# Altium schematic sheet Sheet2.SchDoc
size A4
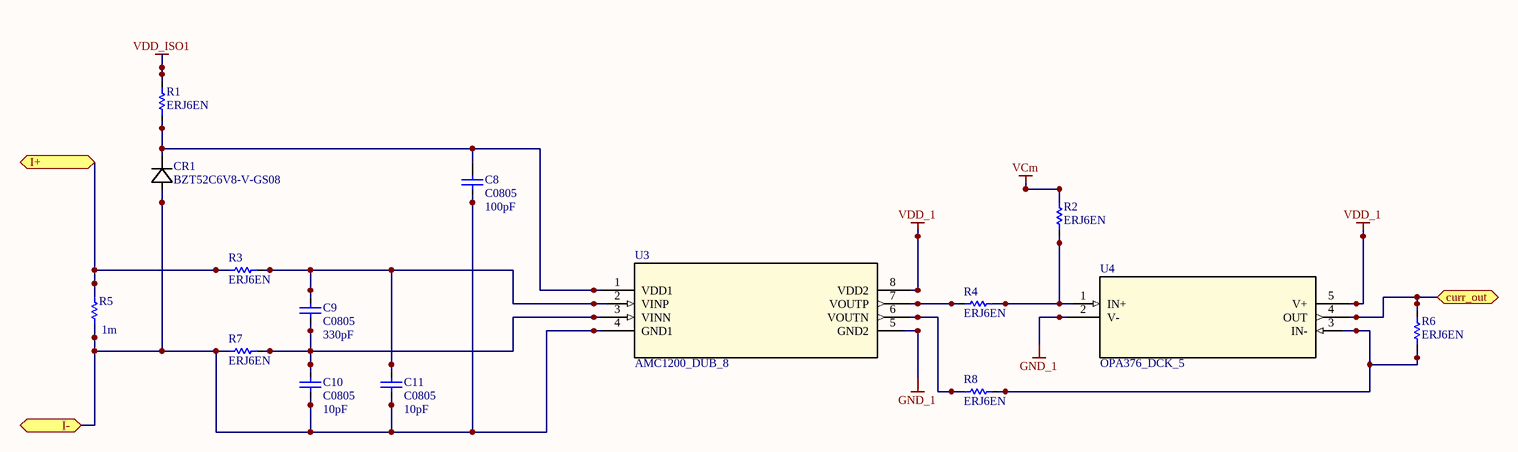
[diagram p0: Sheet2.SchDoc]

## Parts
C8  C0805  value 100pF  [0805]
C9  C0805  value 330pF  [0805]
C10  C0805  value 10pF  [0805]
C11  C0805  value 10pF  [0805]
CR1  BZT52C6V8-V-GS08  [SOD123]
R1  ERJ6EN  [6-0805]
R2  ERJ6EN  [6-0805]
R3  ERJ6EN  [6-0805]
R4  ERJ6EN  [6-0805]
R5  value 1m  [M1WT-2512]  (hidden comment: ERJM1WT)
R6  ERJ6EN  [6-0805]
R7  ERJ6EN  [6-0805]
R8  ERJ6EN  [6-0805]
U3  AMC1200_DUB_8  [DUB8]
U4  OPA376_DCK_5  [DCK5]

## Ports
curr_out, I+, I-

## Nets
GND_1: U3.5(GND2) U4.2(V-)
VCm: R2.2
VDD_1: U3.8(VDD2) U4.5(V+)
VDD_ISO1: R1.2
curr_out: R6.2 U4.4(OUT) ; port curr_out
I+: R3.1 R5.2 ; port I+
I-: C8.1 C10.1 C11.1 CR1.2 R5.1 R7.1 U3.4(GND1) ; port I-
NetC8_2: C8.2 CR1.1 R1.1 U3.1(VDD1)
NetC9_1: C9.1 C10.2 R7.2 U3.3(VINN)
NetC9_2: C9.2 C11.2 R3.2 U3.2(VINP)
NetR2_1: R2.1 R4.2 U4.1(IN+)
NetR4_1: R4.1 U3.7(VOUTP)
NetR6_1: R6.1 R8.2 U4.3(IN-)
NetR8_1: R8.1 U3.6(VOUTN)

## Library data of the parts
C8-C11 = C0805: Ceramic Chip Capacitor - Standard; Note: Footprint corresponds to dimensions for bulk cassette packaging. This case size has tightened tolerances.; Published: 17-Jul-2002; LatestRevisionDate: 19-Mar-2004; LatestRevisionNote: Silkscreen size reduced.; DatasheetDocument: Mar-2001; PackageDocument: Mar-2001; PackageReference: 0805; Publisher: Altium Limited; Code_JEITA: 0805; Code_IPC: 2012[0805]; ComponentLink1Description: Manufacturer Link; ComponentLink1URL: http://www.kemet.com/; ComponentLink2Description: Datasheet; ComponentLink2URL: http://www.kemet.com/kemet/web/homepage/kechome.nsf/vapubfilesname/F3102TA.pdf/$file/F3102TA.pdf
CR1 = BZT52C6V8-V-GS08: Imported; Vendor: Vishay; Built_By: EMA_UL_Team; C: Copyright (C) 2015 Accelerated Designs. All rights reserved; Manufacturer_Part_Number: BZT52C6V8-V-GS08; Value: Value
R1-R4 R6-R8 = ERJ6EN: Precision Thick Film Chip Resistor, 10 Ohm to 2.2M Ohm Range, 1% Tolerance, 0805 Size, 0.1 W; Published: 17-Dec-2003; LatestRevisionDate: 19-Mar-2004; LatestRevisionNote: Silkscreen size reduced.; PackageDocument: Mar-2003; PackageReference: 6-0805; Publisher: Altium Limited; Code_IPC: 2012 [0805]; ComponentLink1Description: Manufacturer Link; ComponentLink1URL: http://www.panasonic.com/industrial/components/resistive_products.htm; ComponentLink2Description: Datasheet; ComponentLink2URL: http://www.panasonic.com/industrial/components/pdf/AOA0000CE2.pdf
R5 = ERJM1WT: Low Resistance Value Chip Resistor, 2m Ohm to 4m Ohm Range, 1% and 5% Tolerance, 2512 Size, 1 W; Note: See manufacturer datasheet for alternative land pattern; Published: 17-Dec-2003; LatestRevisionDate: 19-Mar-2004; LatestRevisionNote: Silkscreen size reduced.; PackageDocument: Mar-2003; PackageReference: M1WT-2512; Publisher: Altium Limited; ComponentLink1Description: Manufacturer Link; ComponentLink1URL: http://www.panasonic.com/industrial/components/resistive_products.htm; ComponentLink2Description: Datasheet; ComponentLink2URL: http://www.panasonic.com/industrial/components/pdf/AOA0000CE7.pdf
U3 = AMC1200_DUB_8: Imported; Manufacturer: Texas Instruments; INDUSTRY_STD_PKG_TYPE: SOP; FAMILY_NAME: ISOLATED ADC; PIN_COUNT: 8; PACKAGE_DESIGNATOR: DUB; Datasheet_URL: http://www.ti.com/lit/gpn/AMC1200; GENERIC_PART_NUMBER: AMC1200; Value: Value; Type: Type; RefDes: RefDes
U4 = OPA376_DCK_5: Imported; Manufacturer: Texas Instruments; GENERIC_PART_NUMBER: OPA376; INDUSTRY_STD_PKG_TYPE: SC70; FAMILY_NAME: LOW OFFSET VOLTAGE; PIN_COUNT: 5; PACKAGE_DESIGNATOR: DCK; Datasheet_URL: http://www.ti.com/lit/gpn/OPA376; Vendor: Texas Instruments; Manufacturer_Part_Number: opa376_dck_5; Value: Value; Type: Type; RefDes: RefDes